# EAGLE design domino-clock-r2-displayonly (EAGLE 5.11)
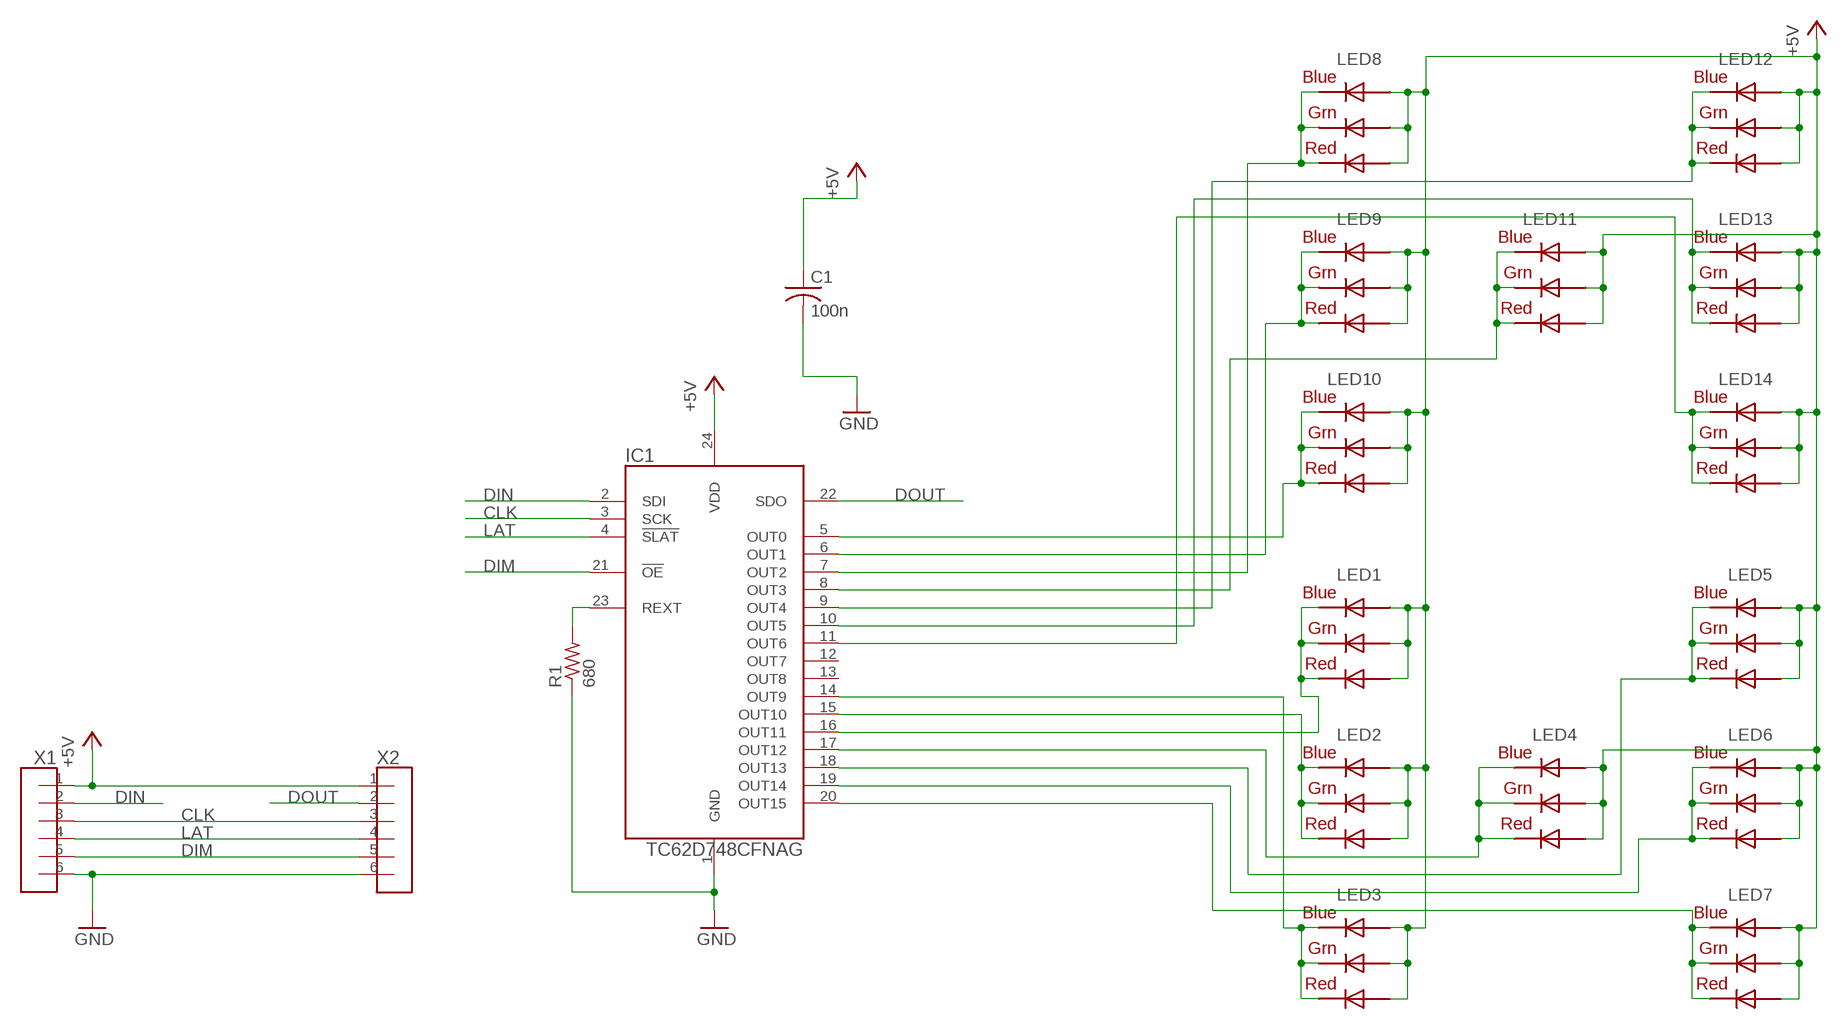
[diagram p0: schematic, sheet 1]

## Parts
C1  100n  C-USC0603  [C0603]
IC1  TC62D748CFNAG  [SSOP24-0.64]
LED1  RGBLED5050  [RGBLED5050]
LED2  RGBLED5050  [RGBLED5050]
LED3  RGBLED5050  [RGBLED5050]
LED4  RGBLED5050  [RGBLED5050]
LED5  RGBLED5050  [RGBLED5050]
LED6  RGBLED5050  [RGBLED5050]
LED7  RGBLED5050  [RGBLED5050]
LED8  RGBLED5050  [RGBLED5050]
LED9  RGBLED5050  [RGBLED5050]
LED10  RGBLED5050  [RGBLED5050]
LED11  RGBLED5050  [RGBLED5050]
LED12  RGBLED5050  [RGBLED5050]
LED13  RGBLED5050  [RGBLED5050]
LED14  RGBLED5050  [RGBLED5050]
R1  680  R-US_R0603  [R0603]
X1  M06-100MIL  [100MIL-6]
X2  M06-100MIL  [100MIL-6]

## Nets
+5V: C1.1 IC1.24(VDD) LED1.1(GREEN_A) LED1.2(RED_A) LED1.3(BLUE_A) LED2.1(GREEN_A) LED2.2(RED_A) LED2.3(BLUE_A) LED3.1(GREEN_A) LED3.2(RED_A) LED3.3(BLUE_A) LED4.1(GREEN_A) LED4.2(RED_A) LED4.3(BLUE_A) LED5.1(GREEN_A) LED5.2(RED_A) LED5.3(BLUE_A) LED6.1(GREEN_A) LED6.2(RED_A) LED6.3(BLUE_A) LED7.1(GREEN_A) LED7.2(RED_A) LED7.3(BLUE_A) LED8.1(GREEN_A) LED8.2(RED_A) LED8.3(BLUE_A) LED9.1(GREEN_A) LED9.2(RED_A) LED9.3(BLUE_A) LED10.1(GREEN_A) LED10.2(RED_A) LED10.3(BLUE_A) LED11.1(GREEN_A) LED11.2(RED_A) LED11.3(BLUE_A) LED12.1(GREEN_A) LED12.2(RED_A) LED12.3(BLUE_A) LED13.1(GREEN_A) LED13.2(RED_A) LED13.3(BLUE_A) LED14.1(GREEN_A) LED14.2(RED_A) LED14.3(BLUE_A) X1.1 X2.1
CLK: IC1.3(SCK) X1.3 X2.3
DIM: IC1.21(!OE) X1.5 X2.5
DIN: IC1.2(SDI) X1.2
DOUT: IC1.22(SDO) X2.2
GND: C1.2 IC1.1(GND) R1.1 X1.6 X2.6
LAT: IC1.4(!SLAT) X1.4 X2.4
N$8: IC1.23(REXT) R1.2
N$9: IC1.16(OUT11) LED1.4(BLUE_C) LED1.5(RED_C) LED1.6(GREEN_C)
N$10: IC1.15(OUT10) LED2.4(BLUE_C) LED2.5(RED_C) LED2.6(GREEN_C)
N$11: IC1.17(OUT12) LED4.4(BLUE_C) LED4.5(RED_C) LED4.6(GREEN_C)
N$12: IC1.14(OUT9) LED3.4(BLUE_C) LED3.5(RED_C) LED3.6(GREEN_C)
N$16: IC1.18(OUT13) LED5.4(BLUE_C) LED5.5(RED_C) LED5.6(GREEN_C)
N$18: IC1.19(OUT14) LED6.4(BLUE_C) LED6.5(RED_C) LED6.6(GREEN_C)
N$22: IC1.20(OUT15) LED7.4(BLUE_C) LED7.5(RED_C) LED7.6(GREEN_C)
N$23: IC1.7(OUT2) LED8.4(BLUE_C) LED8.5(RED_C) LED8.6(GREEN_C)
N$24: IC1.6(OUT1) LED9.4(BLUE_C) LED9.5(RED_C) LED9.6(GREEN_C)
N$25: IC1.5(OUT0) LED10.4(BLUE_C) LED10.5(RED_C) LED10.6(GREEN_C)
N$26: IC1.8(OUT3) LED11.4(BLUE_C) LED11.5(RED_C) LED11.6(GREEN_C)
N$27: IC1.9(OUT4) LED12.4(BLUE_C) LED12.5(RED_C) LED12.6(GREEN_C)
N$28: IC1.10(OUT5) LED13.4(BLUE_C) LED13.5(RED_C) LED13.6(GREEN_C)
N$29: IC1.11(OUT6) LED14.4(BLUE_C) LED14.5(RED_C) LED14.6(GREEN_C)
Unconnected: IC1.12(OUT7) IC1.13(OUT8)

## Library data of the parts
C1 = rcl:C-US: CAPACITOR, American symbol
IC1 = rbg-toshiba-leddriver:TC62D748CFNAG
LED1-LED14 = adafruit:RGBLED: For 5050 RGB LEDs, the order of the LEDs may vary from one manufacturer to another!
R1 = rcl:R-US_: RESISTOR, American symbol
X1 X2 = rbg-generic-headers:M06-100MIL

## Board
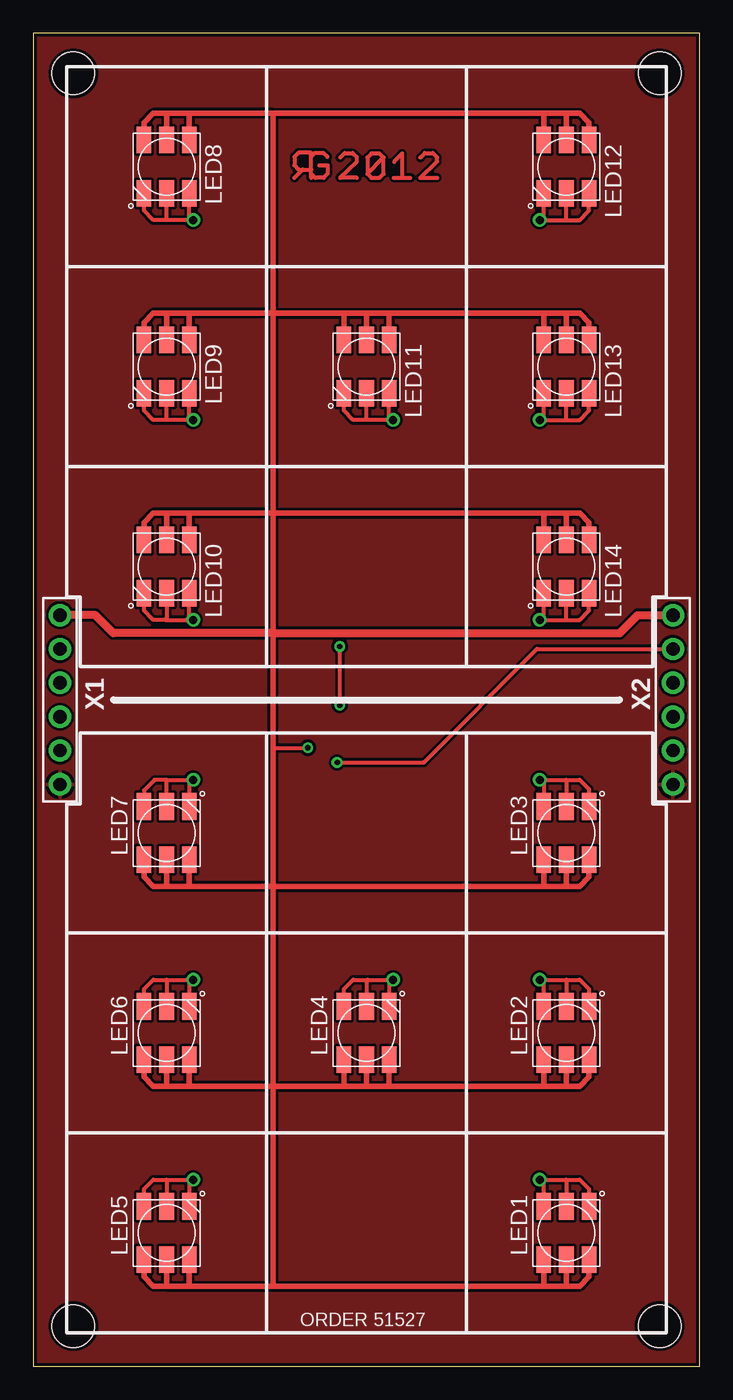
[diagram p1: board, top side]
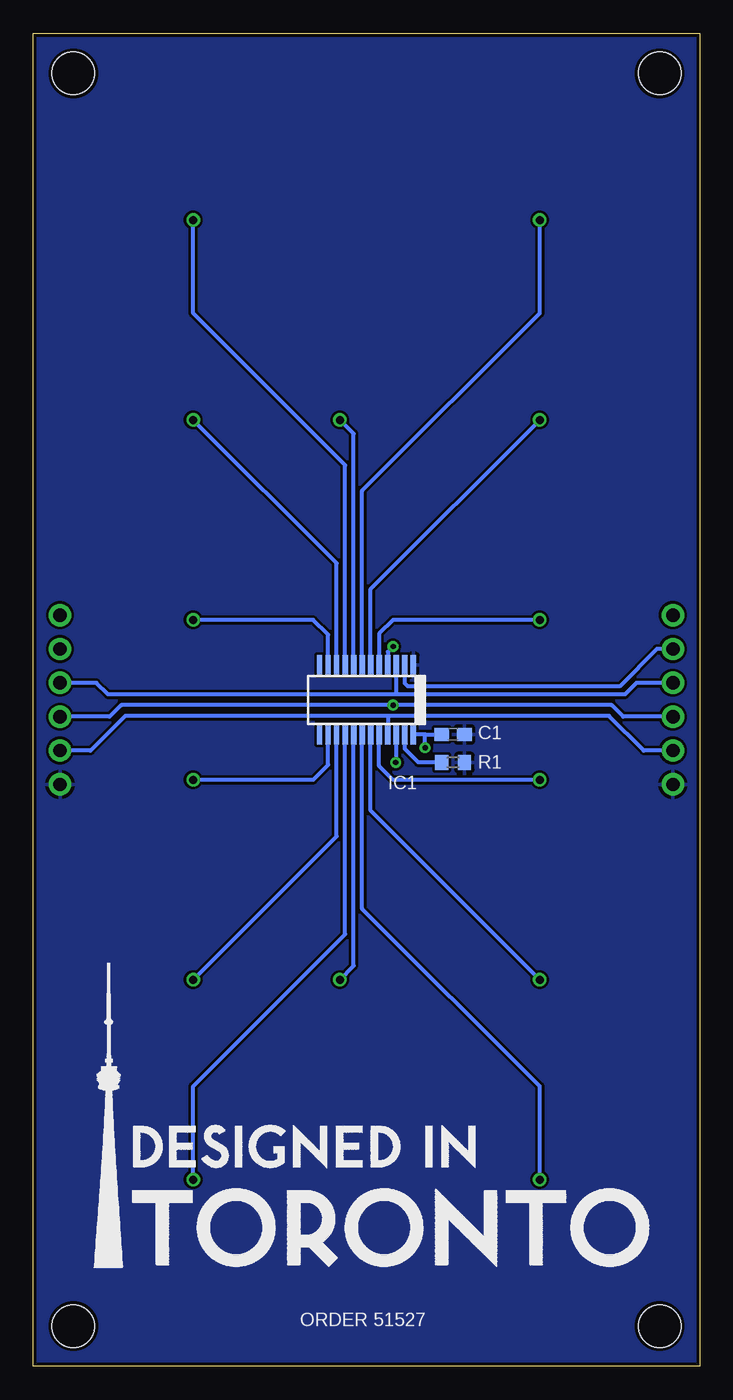
[diagram p2: board, bottom side, seen from below]

Size 50 x 100 mm. Coordinates in mm from the lower left corner, seen from the top.
Outline: 0,0 50,0 50,100 0,100 0,0
Copper layers (1*16): Top 0.035mm / dielectric 1.5mm / Bottom 0.035mm
Design rules "default *": minimum track width 8mil, minimum drill 12mil, track to track 8mil, track to pad 8mil, pad to pad 8mil, via to via 8mil, smd to smd 8mil, copper to edge 10mil, drill to drill 8mil, minimum pad ring 10mil, minimum via ring 8mil, stop-mask expansion 4mil, vias tented up to drill 18mil, thermal gap 10mil
Holes 3.2 mm at 3,97 47,97 47,3 3,3

### Footprints (pad centres in the part's own frame; a part is rotated, then mirrored left to right if it is on the bottom)
C0603 = smd 1.1 x 1: 1 -0.85,0; 2 0.85,0
SSOP24-0.64 = smd 0.4 x 1.5: 1 -3.52,-2.6; 2 -2.88,-2.6; 3 -2.24,-2.6; 4 -1.6,-2.6; 5 -0.96,-2.6; 6 -0.32,-2.6; 7 0.32,-2.6; 8 0.96,-2.6; 9 1.6,-2.6; 10 2.24,-2.6; 11 2.88,-2.6; 12 3.52,-2.6; 13 3.52,2.6; 14 2.88,2.6; 15 2.24,2.6; 16 1.6,2.6; 17 0.96,2.6; 18 0.32,2.6; 19 -0.32,2.6; 20 -0.96,2.6; 21 -1.6,2.6; 22 -2.24,2.6; 23 -2.88,2.6; 24 -3.52,2.6
RGBLED5050 = smd 2 x 1.1: 1 -2,1.7; 2 -2,0; 3 -2,-1.7; 4 2,-1.7; 5 2,0; 6 2,1.7
R0603 = smd 1 x 1.1: 1 -0.85,0; 2 0.85,0
100MIL-6 = drill 1 pad 1.676 round: 1 -6.35,0; 2 -3.81,0; 3 -1.27,0; 4 1.27,0; 5 3.81,0; 6 6.35,0

### Placement (x,y rotation side)
C1  18.5,47.4 0 bottom
IC1  25,50 180 bottom
LED1  40,10 90 top
LED2  40,25 90 top
LED3  40,40 90 top
LED4  25,25 90 top
LED5  10,10 90 top
LED6  10,25 90 top
LED7  10,40 90 top
LED8  10,90 270 top
LED9  10,75 270 top
LED10  10,60 270 top
LED11  25,75 270 top
LED12  40,90 270 top
LED13  40,75 270 top
LED14  40,60 270 top
R1  18.5,45.3 180 bottom
U$1  [DESIGNED_IN_TORONTO]  46,7 0 bottom
U$2  [RGLOGO_SMALL_2012]  21,89 0 top
X1  2,50 270 top
X2  48,50 270 top

### Tracks (layer width: path | path; a pad name or v marks a point on that pad's centre or on a via)
+5V  (via drill 0.4)
  Top 0.305: 18,46.4 v20.6,46.4
  Top 0.406: LED8.3 8.3,93.3 9,94 10,94 | LED12.1 41.7,93.3 41,94 40,94 | 11.7,94 10,94 | 18,94 11.7,94 | 18,94 38.3,94 | 38.3,94 40,94 | LED9.3 8.3,78.3 9,79 10,79 | LED13.1 41.7,78.3 41,79 40,79 | 11.7,79 10,79 | 18,79 11.7,79 | 18,79 23.3,79 | 23.3,79 25,79 | 26.7,79 38.3,79 | 38.3,79 40,79 | LED10.3 8.3,63.3 9,64 10,64 | LED14.1 41.7,63.3 41,64 40,64 | 11.7,64 10,64 | 38.3,64 40,64 | 10,94 LED8.2 | 11.7,94 LED8.1 | 40,94 LED12.2 | 38.3,94 LED12.3 | 40,79 LED13.2 | 38.3,79 LED13.3 | 26.7,79 LED11.1 | 25,79 LED11.2 | 23.3,79 LED11.3 | 11.7,79 LED9.1 | 10,79 LED9.2 | 10,64 LED10.2 | 11.7,64 LED10.1 | 18,64 38.3,64 | 25,79 26.7,79 | 18,79 18,94 | 38.3,64 LED14.3 | 40,64 LED14.2 | 18,64 18,55 18,46.4 18,36 | 18,64 11.7,64 | 18,64 18,79 | LED5.1 8.3,6.7 9,6 10,6 | LED1.3 41.7,6.7 41,6 40,6 | 10,6 11.7,6 | 11.7,6 18,6 | 18,6 38.3,6 | 38.3,6 40,6 | LED6.1 8.3,21.7 9,21 10,21 | LED2.3 41.7,21.7 41,21 40,21 | 11.7,21 10,21 | 18,21 11.7,21 | 18,21 23.3,21 | 23.3,21 25,21 | 26.7,21 38.3,21 | 38.3,21 40,21 | LED7.1 8.3,36.7 9,36 10,36 | LED3.3 41.7,36.7 41,36 40,36 | 11.7,36 10,36 | 18,36 11.7,36 | 18,36 38.3,36 | 10,36 LED7.2 | 11.7,36 LED7.3 | 40,36 LED3.2 | 38.3,36 LED3.1 | 38.3,21 LED2.1 | 40,21 LED2.2 | 26.7,21 LED4.3 | 25,21 LED4.2 | 23.3,21 LED4.1 | 10,21 LED6.2 | 11.7,21 LED6.3 | 10,6 LED5.2 | 11.7,6 LED5.3 | 40,6 LED1.2 | 38.3,6 LED1.1 | 25,21 26.7,21 | 18,6 18,21 | 38.3,36 40,36 | 18,21 18,36
  Top 0.61: X1.1 4.65,56.35 6,55 18,55 44,55 45.35,56.35 X2.1
  Bottom 0.305: 20.6,47.4 IC1.24 | 20.6,47.4 C1.1 | v20.6,46.4 20.6,47.4
CLK
  Bottom 0.305: X1.3 4.73,51.27 5.6,50.4 22.7,50.4 | X2.3 45.27,51.27 44.4,50.4 22.7,50.4 | IC1.3 22.76,50.46 22.7,50.4
DIM
  Bottom 0.305: X1.5 4.19,46.19 6.8,48.8 23.4,48.8 | X2.5 45.71,46.19 43.1,48.8 23.4,48.8 | 23.4,48.8 IC1.21
DIN
  Bottom 0.305: X1.2 3.19,53.81 6,51 21.9,51 22.12,51.22 IC1.2
DOUT  (via drill 0.4)
  Top 0.305: v22.8,45.3 29.3,45.3 37.81,53.81 X2.2
  Bottom 0.305: IC1.22 22.76,45.34 v22.8,45.3
GND
  pour Top: -1,-1 51,-1 51,101 -1,101
  pour Bottom: -1,-1 51,-1 51,101 -1,101
LAT  (via drill 0.4)
  Top 0.305: v23,49.6 v23,54
  Bottom 0.305: X1.4 5.73,48.73 6.6,49.6 v23,49.6 43.4,49.6 44.27,48.73 X2.4 | IC1.4 23.4,53.6 v23,54
N$8
  Bottom 0.305: IC1.23 22.12,46.32 21.1,45.3 R1.2
N$9  (via drill 0.6)
  Top 0.305: 40,14 v38,14 38.3,13.7 LED1.6 | 40,14 41,14 41.7,13.3 LED1.4 | 40,14 LED1.5
  Bottom 0.305: IC1.16 26.6,32.4 38,21 v38,14
N$10  (via drill 0.6)
  Top 0.305: 40,29 v38,29 38.3,28.7 LED2.6 | 40,29 41,29 41.7,28.3 LED2.4 | 40,29 LED2.5
  Bottom 0.305: IC1.15 27.24,39.76 v38,29
N$11  (via drill 0.6)
  Top 0.305: 25.1,29 24,29 23.3,28.3 LED4.6 | 25.1,29 v27,29 26.7,28.7 LED4.4 | LED4.5 25,28.9 25.1,29
  Bottom 0.305: IC1.17 25.96,30.04 v27,29
N$12  (via drill 0.6)
  Top 0.305: v38,44 38.5,44 | 38.5,44 40,44 | 40,44 41,44 41.7,43.3 LED3.4 | 40,44 LED3.5 | LED3.6 38.3,43.8 38.5,44
  Bottom 0.305: IC1.14 27.88,45.12 29,44 v38,44
N$16  (via drill 0.6)
  Top 0.305: 10,14 9,14 8.3,13.3 LED5.6 | 10,14 v12,14 11.7,13.7 LED5.4 | 10,14 LED5.5
  Bottom 0.305: IC1.18 25.32,34.32 12,21 v12,14
N$18  (via drill 0.6)
  Top 0.305: 10,29 9,29 8.3,28.3 LED6.6 | 10,29 v12,29 11.7,28.7 LED6.4 | 10,29 LED6.5
  Bottom 0.305: IC1.19 24.68,41.68 v12,29
N$22  (via drill 0.6)
  Top 0.305: 10,44 9.1,44 8.3,43.2 LED7.6 | 10,44 v12,44 11.7,43.7 LED7.4 | LED7.5 10,44
  Bottom 0.305: IC1.20 24.04,45.04 23,44 v12,44
N$23  (via drill 0.6)
  Top 0.305: 10,86 v12,86 11.7,86.3 LED8.6 | 10,86 9,86 8.3,86.7 LED8.4 | 10,86 LED8.5
  Bottom 0.305: IC1.7 25.32,65.68 12,79 v12,86
N$24  (via drill 0.6)
  Top 0.305: v12,71 11.5,71 | 11.5,71 10,71 | 10,71 9,71 8.3,71.7 LED9.4 | 10,71 LED9.5 | LED9.6 11.7,71.2 11.5,71
  Bottom 0.305: IC1.6 24.68,58.32 v12,71
N$25  (via drill 0.6)
  Top 0.305: 9.9,56 9,56 8.3,56.7 LED10.4 | 9.9,56 11.5,56 | 11.5,56 v12,56 | LED10.5 10,56.1 9.9,56 | LED10.6 11.7,56.2 11.5,56
  Bottom 0.305: IC1.5 24.04,54.96 23,56 v12,56
N$26  (via drill 0.6)
  Top 0.305: 25,71 v27,71 26.7,71.3 LED11.6 | 25,71 24,71 23.3,71.7 LED11.4 | 25,71 LED11.5
  Bottom 0.305: IC1.8 25.96,69.96 v27,71
N$27  (via drill 0.6)
  Top 0.305: v38,86 38.5,86 | 38.5,86 39.9,86 | 39.9,86 41,86 41.7,86.7 LED12.6 | LED12.5 40,86.1 39.9,86 | LED12.4 38.3,86.2 38.5,86
  Bottom 0.305: IC1.9 26.6,67.6 38,79 v38,86
N$28  (via drill 0.6)
  Top 0.305: 40,71 v38,71 38.3,71.3 LED13.4 | 40,71 41,71 41.7,71.7 LED13.6 | 40,71 LED13.5
  Bottom 0.305: IC1.10 27.24,60.24 v38,71
N$29  (via drill 0.6)
  Top 0.305: 40,56 v38,56 38.3,56.3 LED14.4 | 40,56 41,56 41.7,56.7 LED14.6 | 40,56 LED14.5
  Bottom 0.305: IC1.11 27.88,54.88 29,56 v38,56

### Text on the board
tNames: ORDER 51527
bNames: ORDER 51527